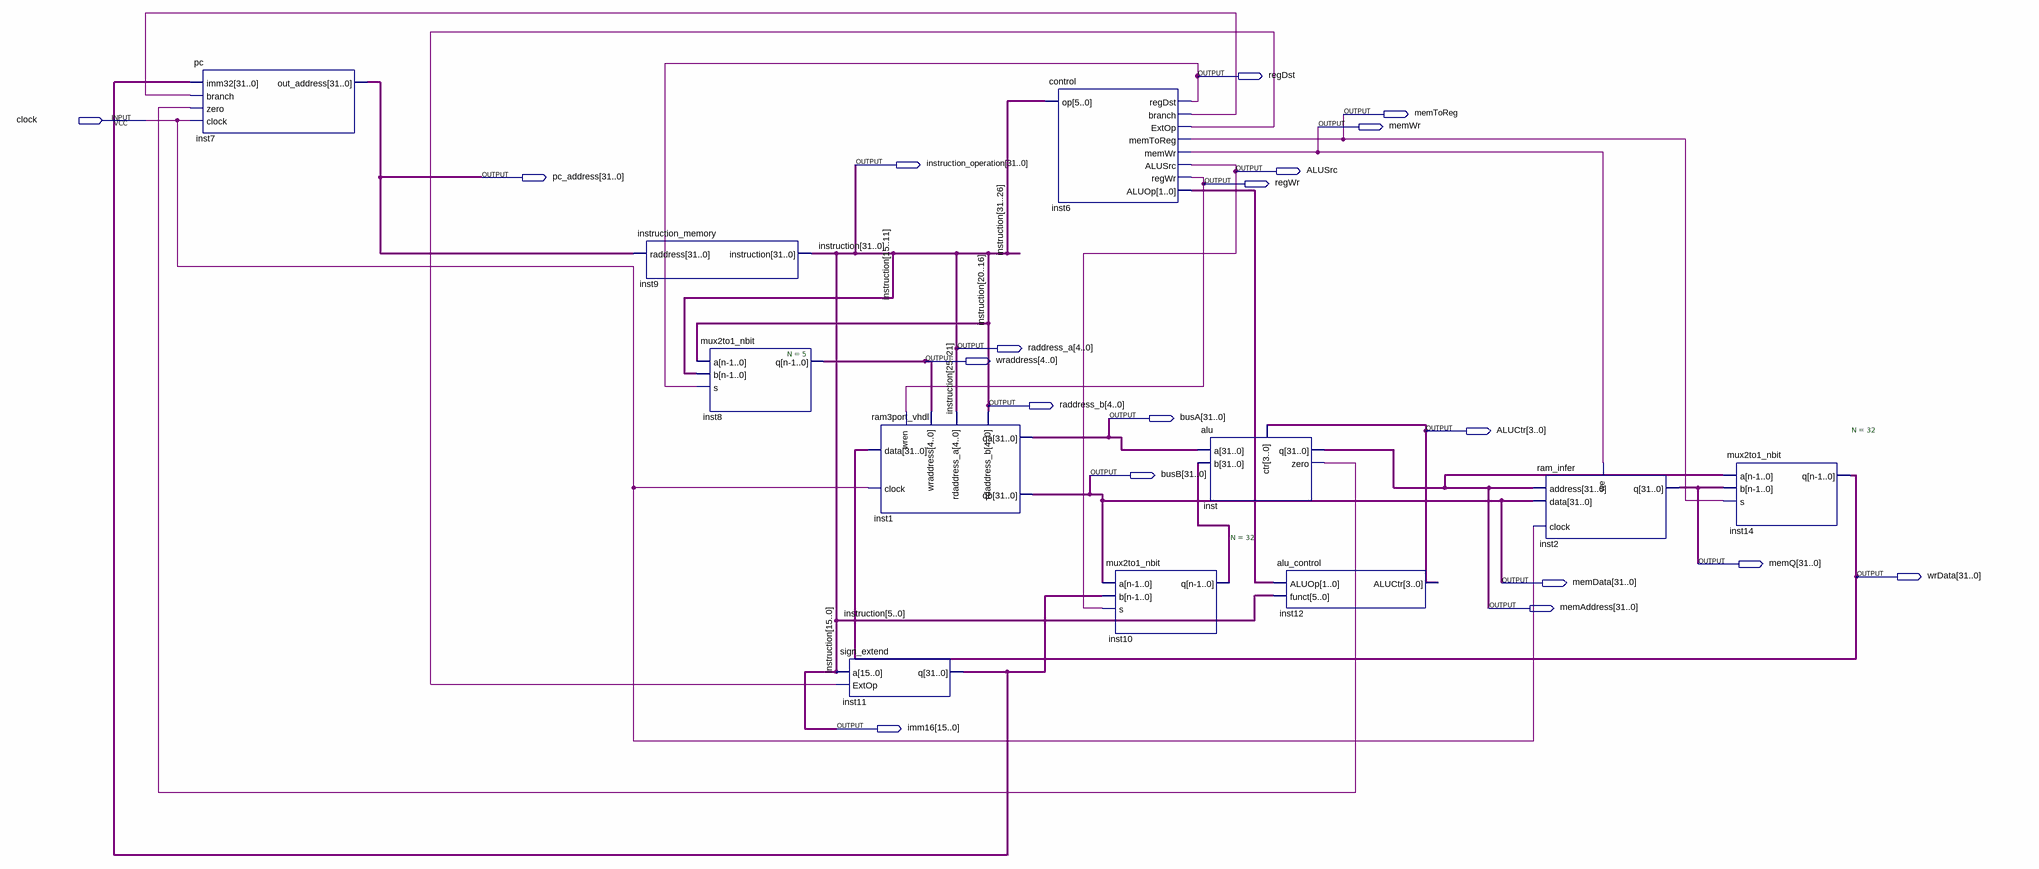
[diagram p0: schematic sheet]
// Quartus schematic single_cycle_cpu.bdf as structural Verilog: 11 symbols, 19 pins
module single_cycle_cpu (
  input  clock,
  output regDst,
  output memToReg,
  output memWr,
  output [31:0] instruction_operation,
  output ALUSrc,
  output [31:0] pc_address,
  output regWr,
  output [4:0] raddress_a,
  output [4:0] wraddress,
  output [4:0] raddress_b,
  output [31:0] busA,
  output [3:0] ALUCtr,
  output [31:0] busB,
  output [31:0] memQ,
  output [31:0] wrData,
  output [31:0] memData,
  output [31:0] memAddress,
  output [15:0] imm16
);

  wire inst6_branch, inst6_extop, inst_zero;
  wire [1:0] inst6_aluop;
  wire [31:0] inst10_q, inst11_q;

  pc inst7 (.imm32(inst11_q), .branch(inst6_branch), .zero(inst_zero), .clock(clock), .out_address(pc_address));
  instruction_memory inst9 (.raddress(pc_address), .instruction({instruction_operation[31:16], imm16}));
  mux2to1_nbit #(.N(5)) inst8 (.a(instruction_operation[20:16]), .b(imm16[15:11]), .s(regDst), .q(wraddress));
  ram3port_vhdl inst1 (
    .clock(clock), .data(wrData), .rdaddress_a(instruction_operation[25:21]),
    .rdaddress_b(instruction_operation[20:16]), .wraddress(wraddress), .wren(regWr), .qa(busA), .qb(busB));
  sign_extend inst11 (.a(imm16), .ExtOp(inst6_extop), .q(inst11_q));
  control inst6 (
    .op(instruction_operation[31:26]), .regDst(regDst), .branch(inst6_branch), .ExtOp(inst6_extop),
    .memToReg(memToReg), .memWr(memWr), .ALUSrc(ALUSrc), .regWr(regWr), .ALUOp(inst6_aluop));
  mux2to1_nbit #(.N(32)) inst10 (.a(busB), .b(inst11_q), .s(ALUSrc), .q(inst10_q));
  alu inst (.a(busA), .b(inst10_q), .ctr(ALUCtr), .q(memAddress), .zero(inst_zero));
  alu_control inst12 (.ALUOp(inst6_aluop), .funct(imm16[5:0]), .ALUCtr(ALUCtr));
  ram_infer inst2 (.address(memAddress), .clock(clock), .data(busB), .we(memWr), .q(memQ));
  mux2to1_nbit #(.N(32)) inst14 (.a(memAddress), .b(memQ), .s(memToReg), .q(wrData));

  assign instruction_operation[15:0] = imm16;
  assign memData = busB;
  assign raddress_a = instruction_operation[25:21];
  assign raddress_b = instruction_operation[20:16];

  // Other names for the same wires on the sheet: instruction[31:0] = {instruction_operation[31:16], imm16}
endmodule
